# Altium schematic sheet EN-C200_RA0_PWR.SchDoc
size A4
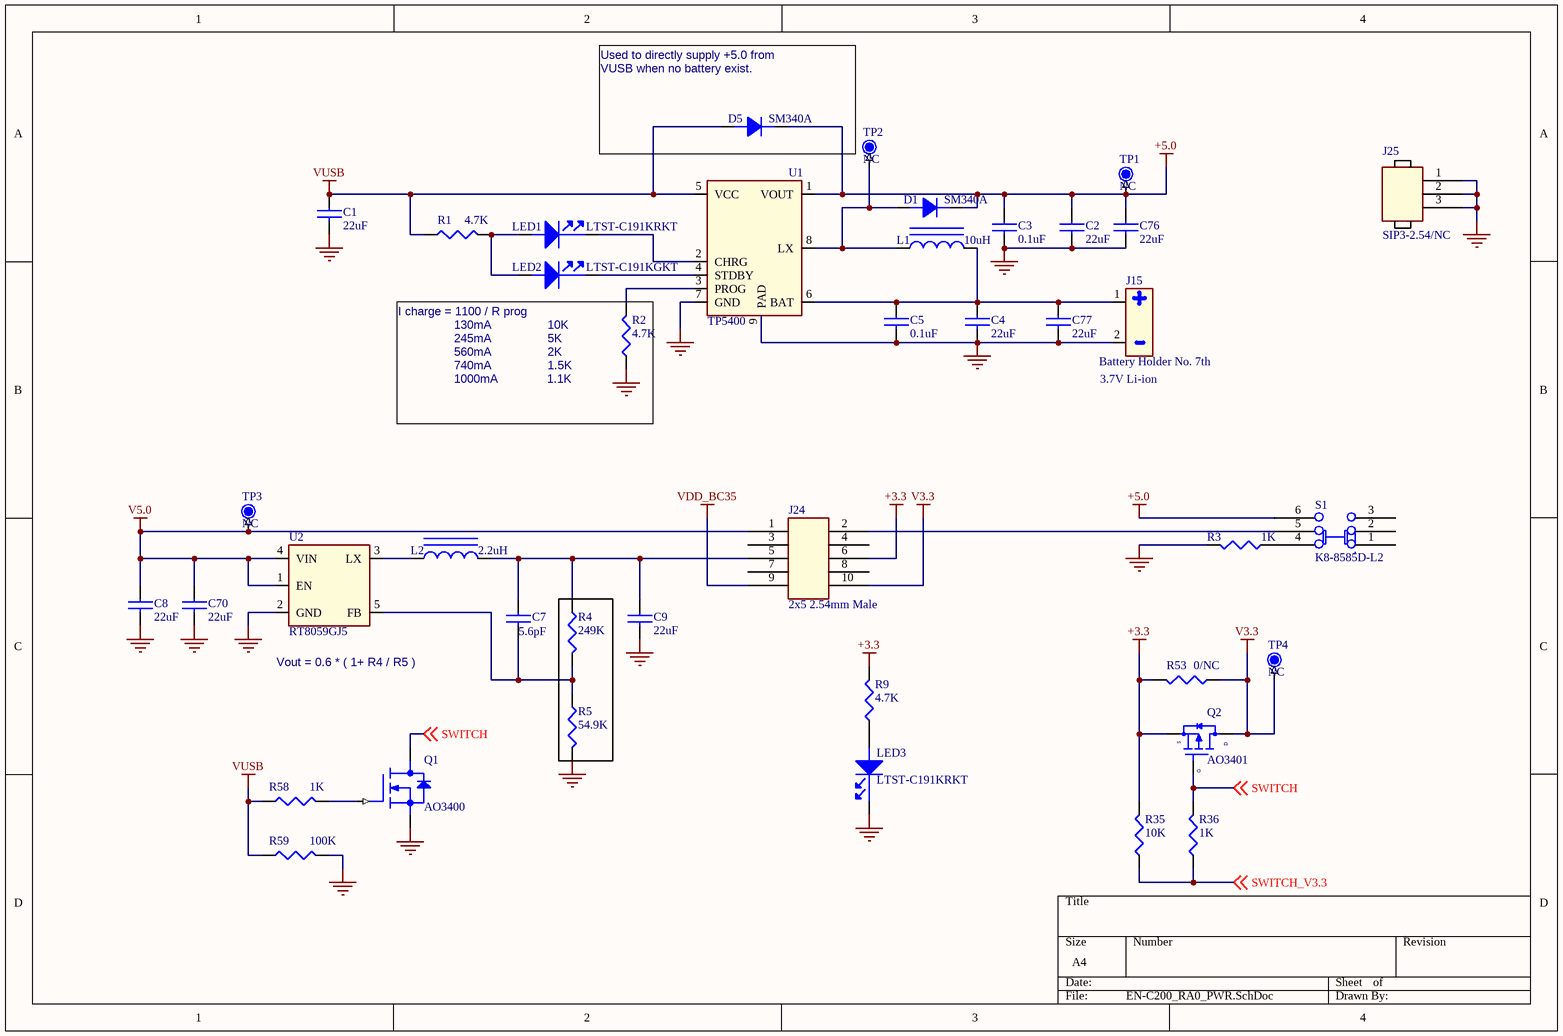
[diagram p0: EN-C200_RA0_PWR.SchDoc]

## Parts
C1  22uF  [SC0805]
C2  22uF  [SC0805]
C3  0.1uF  [SC0603]
C4  22uF  [SC0805]
C5  0.1uF  [SC0603]
C7  5.6pF  [SC0603]
C8  22uF  [SC0805]
C9  22uF  [SC0805]
C70  22uF  [SC0805]
C76  22uF  [SC0805]
C77  22uF  [SC0805]
D1  SM340A  [SD1714]
D5  SM340A  [SD1714]
J15  Battery Holder No. 7th  [BX0034]
J24  2x5 2.54mm Male  [SIP-2X5P-100]
J25  SIP3-2.54/NC  [SIP-3P]
L1  10uH  [SPL0505B]
L2  2.2uH  [SL1008]
LED1  LTST-C191KRKT  [HSD0603-LED]
LED2  LTST-C191KGKT  [HSD0603-LED]
LED3  LTST-C191KRKT  [HSD0603-LED]
Q1  AO3400  [SOT23]
Q2  AO3401  [SOT23]
R1  4.7K  [SR0603]
R2  4.7K  [SR0603]
R3  1K  [SR0603]
R4  249K  [SR0603]
R5  54.9K  [SR0603]
R9  4.7K  [SR0603]
R35  10K  [SR0603]
R36  1K  [SR0603]
R53  0/NC  [SR0603]
R58  1K  [SR0603]
R59  100K  [SR0603]
S1  K8-8585D-L2  [SW2X3-100]
TP1  NC  [TP32-SMD]
TP2  NC  [TP32-SMD]
TP3  NC  [TP32-SMD]
TP4  NC  [TP32-SMD]
U1  TP5400  [SOP8-50-150B]
U2  RT8059GJ5  [SOT23-5]

## Nets
+3.3: J24.6 Q2.2(S) R9.2 R35.2 R53.2
+5.0: C2.1 C3.1 C76.1 D1.2(K) D5.2(K) S1.6 TP1.1 U1.1(VOUT)
GND: C1.2 C2.2 C3.2 C4.2 C5.2 C8.2 C9.2 C70.2 C76.2 C77.2 J15.2 J25.1 J25.2 J25.3 LED3.2 Q1.2(S) R2.1 R3.2 R5.2 R59.2 U1.7(GND) U1.9(PAD) U2.2(GND)
V3.3: J24.10 Q2.3(D) R53.1 TP4.1
V5.0: C8.1 C70.1 J24.1 TP3.1 U2.1(EN) U2.4(VIN)
VDD_BC35: J24.9
VUSB: C1.1 D5.1(A) R1.1 R58.1 R59.1 U1.5(VCC)
SWITCH: Q1.3(D) Q2.1(G) R36.2 ; off-sheet SWITCH
SWITCH_V3.3: R35.1 R36.1 ; off-sheet SWITCH_V3.3
NetC4_1: C4.1 C5.1 C77.1 J15.1 L1.2 U1.6(BAT)
NetC7_1: C7.1 C9.1 J24.5 L2.2 R4.1
NetC7_2: C7.2 R4.2 R5.1 U2.5(FB)
NetD1_1: D1.1(A) L1.1 TP2.1 U1.8(LX)
NetJ24_2: J24.2 S1.5
NetL2_1: L2.1 U2.3(LX)
NetLED1_1: LED1.1 LED2.1 R1.2
NetLED1_2: LED1.2 U1.2(CHRG)
NetLED2_2: LED2.2 U1.4(STDBY)
NetLED3_1: LED3.1 R9.1
NetQ1_1: Q1.1(G) R58.2
NetR2_2: R2.2 U1.3(PROG)
NetR3_1: R3.1 S1.4

Not connected (* = marked no-connect by the designer): J24 3 4 7 8; S1 1 2 3

## Notes on the sheet
- (near D5) Used to directly supply +5.0 from
  VUSB when no battery exist.
- (near J15) 3.7V Li-ion
- (near R2) I charge = 1100 / R prog
  130mA                10K
  245mA                5K
  560mA                2K
  740mA                1.5K
  1000mA              1.1K
- Vout = 0.6 * ( 1+ R4 / R5 )

## Library data of the parts
C1-C5 C7-C9 C70 C76 C77 = CAP NP
D1 D5 = DIODE
J15 = BX0034
J24 = CON10A
J25 = HEADER3
L1 L2 = TOROID IRON
LED1-LED3 = LED
Q1 = MPF6661
Q2 = A03401
R1-R5 R9 R35 R36 R53 R58 R59 = RESISTOR
S1 = SW_PUSH6: SDTSourceLibName: C:\WIND95\TEMP\6200.LIB
TP1-TP4 = TP
U2 = RT8059